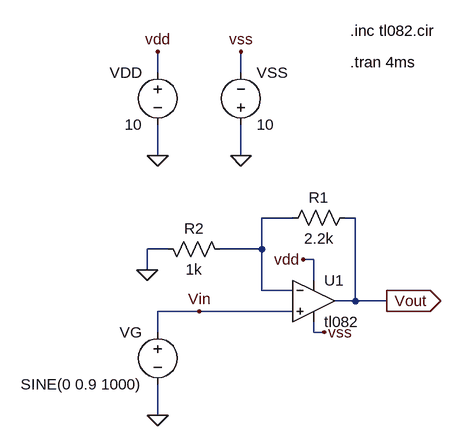
[diagram p0: schematic noninv.asc]
noninv.asc, the LTspice schematic file:
Version 4
SHEET 1 948 680
WIRE -64 -176 -64 -208
WIRE 64 -176 64 -208
WIRE -64 -48 -64 -96
WIRE 64 -48 64 -96
WIRE 144 48 96 48
WIRE 240 48 224 48
WIRE -48 96 -80 96
WIRE 96 96 96 48
WIRE 96 96 32 96
WIRE 176 112 160 112
WIRE -80 128 -80 96
WIRE 176 144 176 112
WIRE 96 160 96 96
WIRE 144 160 96 160
WIRE 240 176 240 48
WIRE 240 176 208 176
WIRE 288 176 240 176
WIRE 0 192 -64 192
WIRE 144 192 0 192
WIRE -64 224 -64 192
WIRE 176 224 176 208
WIRE 192 224 176 224
WIRE -64 352 -64 304
FLAG -64 352 0
FLAG -64 -48 0
FLAG 64 -48 0
FLAG -64 -208 vdd
FLAG 160 112 vdd
FLAG 64 -208 vss
FLAG 192 224 vss
FLAG 0 192 Vin
FLAG -80 128 0
FLAG 288 176 Vout
IOPIN 288 176 Out
SYMBOL voltage -64 208 M0
WINDOW 123 0 0 Left 2
WINDOW 39 0 0 Left 2
SYMATTR InstName VG
SYMATTR Value SINE(0 0.9 1000)
SYMBOL voltage -64 -192 M0
SYMATTR InstName VDD
SYMATTR Value 10
SYMBOL voltage 64 -80 M180
WINDOW 0 24 96 Left 2
WINDOW 3 24 16 Left 2
SYMATTR InstName VSS
SYMATTR Value 10
SYMBOL Opamps\\opamp2 176 112 R0
SYMATTR InstName U1
SYMATTR Value tl082
SYMBOL res 240 32 R90
WINDOW 0 0 56 VBottom 2
WINDOW 3 32 56 VTop 2
SYMATTR InstName R1
SYMATTR Value 2.2k
SYMBOL res 48 112 M270
WINDOW 0 32 56 VTop 2
WINDOW 3 0 56 VBottom 2
SYMATTR InstName R2
SYMATTR Value 1k
TEXT 232 -240 Left 2 !.inc tl082.cir
TEXT 232 -192 Left 2 !.tran 4ms

The netlist it stands for:
* noninv.asc
VG Vin 0 SINE(0 0.9 1000)
VDD vdd 0 10
VSS 0 vss 10
XU1 Vin N001 vdd vss Vout tl082  ; pins In+ In- V+ V- OUT
R1 Vout N001 2.2k
R2 N001 0 1k
.inc tl082.cir
.tran 4ms
.backanno
.end